# Altium project ATSAME54_DEVB.PrjPCB
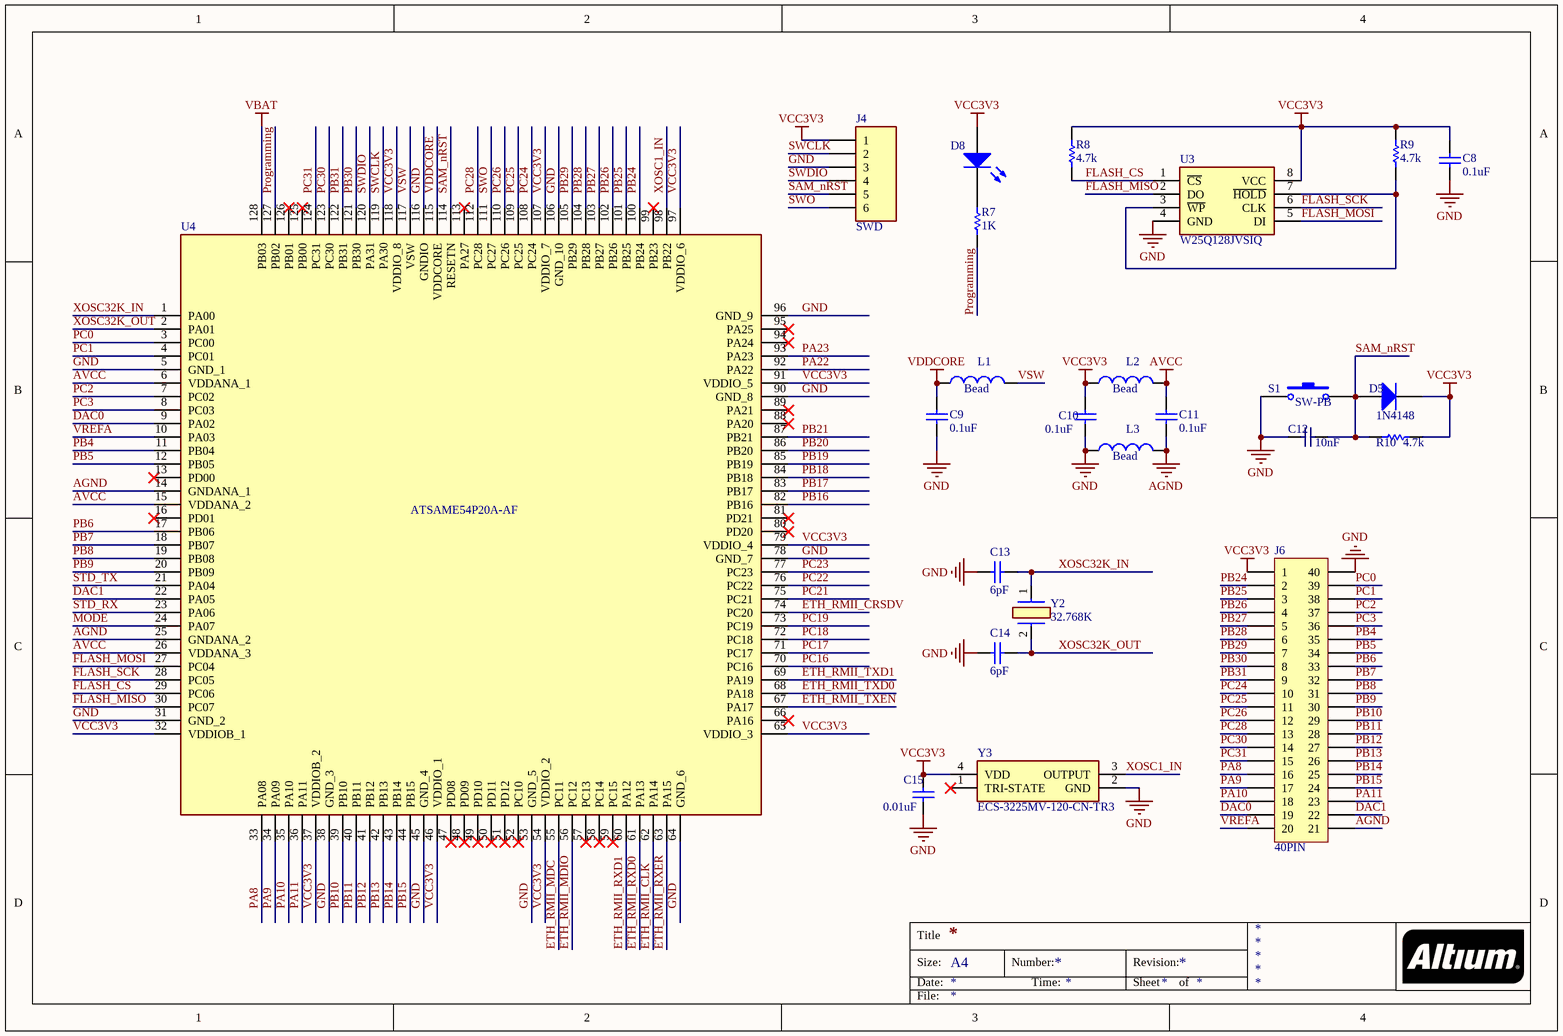
[diagram p0: Main_MCU_ATSAME54.SchDoc]
3 sheets, 81 parts. Net scope: global (net labels, ports and power ports of the same name join across sheets).
Board file: ATSAME54_DEVB.PcbDoc
Sheets:
  Main_MCU_ATSAME54.SchDoc
  Aux_MCU_ATmega16U4.SchDoc
  NIC_DP83848.SchDoc

## Sheet Main_MCU_ATSAME54.SchDoc
size A4

### Parts
C8  0.1uF  [SMD0603]
C9  0.1uF  [SMD0603]
C10  0.1uF  [SMD0603]
C11  0.1uF  [SMD0603]
C12  10nF  [SMD0603]
C13  6pF  [SMD0603]
C14  6pF  [SMD0603]
C15  0.01uF  [SMD0603]
D5  1N4148  [1N4148]
D8  LED0  [SMD0603_LED]  (value not drawn)
J4  SWD  [ISP]
J6  40PIN  [40PIN]
L1  Bead  [SMD0603]
L2  Bead  [SMD0603]
L3  Bead  [SMD0603]
R7  1K  [SMD0603]
R8  4.7k  [SMD0603]
R9  4.7k  [SMD0603]
R10  4.7K  [SMD0603]
S1  SW-PB  [Button]
U3  W25Q128JVSIQ  [SOIC127P790X216-8N]
U4  ATSAME54P20A-AF  [QFP40P1600X1600X120-128N]
Y2  32.768K  [ECS327634RTR]
Y3  ECS-3225MV-120-CN-TR3  [OSC3225]

### Nets
AGND: C11.2 J6.21 L3.2 U4.14(GNDANA_1) U4.25(GNDANA_2)
AVCC: C11.1 L2.2 U4.6(VDDANA_1) U4.15(VDDANA_2) U4.26(VDDANA_3)
GND: C8.2 C9.2 C10.2 C12.1 C13.2 C14.2 C15.1 J4.3 J6.40 L3.1 S1.1 U3.4(GND) U4.5(GND_1) U4.31(GND_2) U4.38(GND_3) U4.45(GND_4) U4.53(GND_5) U4.64(GND_6) U4.78(GND_7) U4.90(GND_8) U4.96(GND_9) U4.106(GND_10) U4.116(GNDIO) Y3.2(GND)
VBAT: U4.128(PB03)
VCC3V3: C8.1 C10.1 C15.2 D5.2 D8.1(A) J4.1 J6.1 L2.1 R8.2 R9.2 R10.2 U3.8(VCC) U4.32(VDDIOB_1) U4.37(VDDIOB_2) U4.46(VDDIO_1) U4.54(VDDIO_2) U4.65(VDDIO_3) U4.79(VDDIO_4) U4.91(VDDIO_5) U4.97(VDDIO_6) U4.107(VDDIO_7) U4.118(VDDIO_8) Y3.4(VDD)
VDDCORE: C9.1 L1.1 U4.115(VDDCORE)
DAC0: J6.19 U4.9(PA02)
DAC1: J6.22 U4.22(PA05)
ETH_RMII_CLK: U4.62(PA14)
ETH_RMII_CRSDV: U4.74(PC20)
ETH_RMII_MDC: U4.55(PC11)
ETH_RMII_MDIO: U4.56(PC12)
ETH_RMII_RXD0: U4.61(PA13)
ETH_RMII_RXD1: U4.60(PA12)
ETH_RMII_RXER: U4.63(PA15)
ETH_RMII_TXD0: U4.68(PA18)
ETH_RMII_TXD1: U4.69(PA19)
ETH_RMII_TXEN: U4.67(PA17)
FLASH_CS: R8.1 U3.1(~{CS}) U4.29(PC06)
FLASH_MISO: U3.2(DO) U4.30(PC07)
FLASH_MOSI: U3.5(DI) U4.27(PC04)
FLASH_SCK: U3.6(CLK) U4.28(PC05)
MODE: U4.24(PA07)
PA8: J6.16 U4.33(PA08)
PA9: J6.17 U4.34(PA09)
PA10: J6.18 U4.35(PA10)
PA11: J6.23 U4.36(PA11)
PA22: U4.92(PA22)
PA23: U4.93(PA23)
PB4: J6.35 U4.11(PB04)
PB5: J6.34 U4.12(PB05)
PB6: J6.33 U4.17(PB06)
PB7: J6.32 U4.18(PB07)
PB8: J6.31 U4.19(PB08)
PB9: J6.30 U4.20(PB09)
PB10: J6.29 U4.39(PB10)
PB11: J6.28 U4.40(PB11)
PB12: J6.27 U4.41(PB12)
PB13: J6.26 U4.42(PB13)
PB14: J6.25 U4.43(PB14)
PB15: J6.24 U4.44(PB15)
PB16: U4.82(PB16)
PB17: U4.83(PB17)
PB18: U4.84(PB18)
PB19: U4.85(PB19)
PB20: U4.86(PB20)
PB21: U4.87(PB21)
PB24: J6.2 U4.100(PB24)
PB25: J6.3 U4.101(PB25)
PB26: J6.4 U4.102(PB26)
PB27: J6.5 U4.103(PB27)
PB28: J6.6 U4.104(PB28)
PB29: J6.7 U4.105(PB29)
PB30: J6.8 U4.121(PB30)
PB31: J6.9 U4.122(PB31)
PC0: J6.39 U4.3(PC00)
PC1: J6.38 U4.4(PC01)
PC2: J6.37 U4.7(PC02)
PC3: J6.36 U4.8(PC03)
PC16: U4.70(PC16)
PC17: U4.71(PC17)
PC18: U4.72(PC18)
PC19: U4.73(PC19)
PC21: U4.75(PC21)
PC22: U4.76(PC22)
PC23: U4.77(PC23)
PC24: J6.10 U4.108(PC24)
PC25: J6.11 U4.109(PC25)
PC26: J6.12 U4.110(PC26)
PC28: J6.13 U4.112(PC28)
PC30: J6.14 U4.123(PC30)
PC31: J6.15 U4.124(PC31)
Programming: R7.1 U4.127(PB02)
SAM_nRST: C12.2 D5.1 J4.5 R10.1 S1.2 U4.114(RESETN)
STD_RX: U4.23(PA06)
STD_TX: U4.21(PA04)
SWCLK: J4.2 U4.119(PA30)
SWDIO: J4.4 U4.120(PA31)
SWO: J4.6 U4.111(PC27)
VREFA: J6.20 U4.10(PA03)
VSW: L1.2 U4.117(VSW)
XOSC1_IN: U4.98(PB22) Y3.3(OUTPUT)
XOSC32K_IN: C13.1 U4.1(PA00) Y2.1(OUT/IN)
XOSC32K_OUT: C14.1 U4.2(PA01) Y2.2(OUT/IN)
NetD8_2: D8.2(K) R7.2
NetR9_1: R9.1 U3.3(~{WP}) U3.7(~{HOLD})

Not connected (* = marked no-connect by the designer): U4 13(PD00)* 16(PD01)* 47(PD08)* 48(PD09)* 49(PD10)* 50(PD11)* 51(PD12)* 52(PC10)* 57(PC13)* 58(PC14)* 59(PC15)* 66(PA16)* 80(PD20)* 81(PD21)* 88(PA20)* 89(PA21)* 94(PA24)* 95(PA25)* 99(PB23)* 113(PA27)* 125(PB00)* 126(PB01)*; Y3 1(TRI-STATE)*

### Notes on the sheet
- Title
- Size:
- Date:
- A4
- Number:
- Time:
- Revision:
- Sheet
- of
- File:

### Library data of the parts
C8-C11 C13-C15 = Cap Semi: Capacitor (Semiconductor SIM Model); Published: 8-Jun-2000; LatestRevisionDate: 29-May-2009; LatestRevisionNote: IPC-7351 Footprint Added.; PackageReference: C1206; Publisher: Altium Limited; PackageDescription: Chip Capacitor
  C8-C11: Value: 0.1uF
  C13 C14: Value: 6pF
  C15: Value: 0.01uF
C12 = Cap: Capacitor (Semiconductor SIM Model); Value: 10nF
D5 = Diode 1N4148: Diode; Note: Pin 2 is not connected and not drawn.; Published: 21-Mar-2003; DatasheetDocument: Oct-1999; PackageDocument: Sep-2001; PackageReference: SOT-23; Publisher: Altium Limited; ComponentLink1Description: Manufacturer Link; ComponentLink1URL: http://www.infineon.com/
D8 = LED0: Typical INFRARED GaAs LED; Published: 8-Jun-2000; LatestRevisionDate: 08-Jul-2005; LatestRevisionNote: Mech Layer 1 removed.; PackageReference: LED-0; Publisher: Altium Limited; PackageDescription: LED; 2 Leads
J6 = 2x20_header
L1-L3 = Inductor: Code_IEC: 1005; Published: 8-Jun-2000; LatestRevisionDate: 29-May-2009; LatestRevisionNote: IPC-7351 Footprint Added.; PackageReference: 0402-A; Publisher: Altium Limited; PackageDescription: Chip Inductor; Code_JEITA: 0402; Value: Bead
R7 = Res Semi: Semiconductor Resistor; Published: 8-Jun-2000; LatestRevisionDate: 17-Jul-2002; LatestRevisionNote: Re-released for DXP Platform.; PackageReference: AXIAL-0.5; Publisher: Altium Limited; PackageDescription: Axial Device, Thru-Hole; 2 Leads; 0.5 in Pin Spacing; Value: 1K
R8-R10 = Res: Semiconductor Resistor; Value: 4.7k
S1 = SW-PB: Switch; Published: 24-Mar-1999; LatestRevisionDate: 17-Jul-2002; LatestRevisionNote: Re-released for DXP Platform.; PackageReference: SPST-2; Publisher: Altium Limited; PackageDescription: Switch; 2 Leads
U3 = W25Q128JVSIQ: Integrated Circuit; Manufacturer_Name: Winbond; Datasheet Link: https://componentsearchengine.com//W25Q128JVSIQ.pdf; Height: 2.16mm; Mouser2 Part Number: 454-W25Q128JVSIQ; Mouser2 Price/Stock: https://www.mouser.com/Search/Refine.aspx?Keyword=454-W25Q128JVSIQ; Manufacturer_Part_Number: W25Q128JVSIQ
U4 = ATSAME54P20A-AF: Integrated Circuit; Manufacturer_Name: Microchip; Datasheet Link: https://componentsearchengine.com//ATSAME54P20A-AF.pdf; Height: 1.2mm; Mouser2 Part Number: 556-ATSAME54P20A-AF; Mouser2 Price/Stock: https://www.mouser.com/Search/Refine.aspx?Keyword=556-ATSAME54P20A-AF; Manufacturer_Part_Number: ATSAME54P20A-AF
Y2 = ECS-.327-6-34R-TR: Crystal or Oscillator; Manufacturer_Name: ECS; Datasheet Link: https://ecsxtal.com/store/pdf/ECX_34R.pdf; Height: 0.9mm; Manufacturer_Part_Number: ECS-.327-6-34R-TR
Y3 = ECS-3225MV-120-CN-TR3: Crystal or Oscillator; Manufacturer_Name: ECS; Datasheet Link: https://ecsxtal.com/store/pdf/ECS-3225MV.pdf; Height: 1.2mm; Manufacturer_Part_Number: ECS-3225MV-120-CN-TR3

## Sheet Aux_MCU_ATmega16U4.SchDoc
size A4
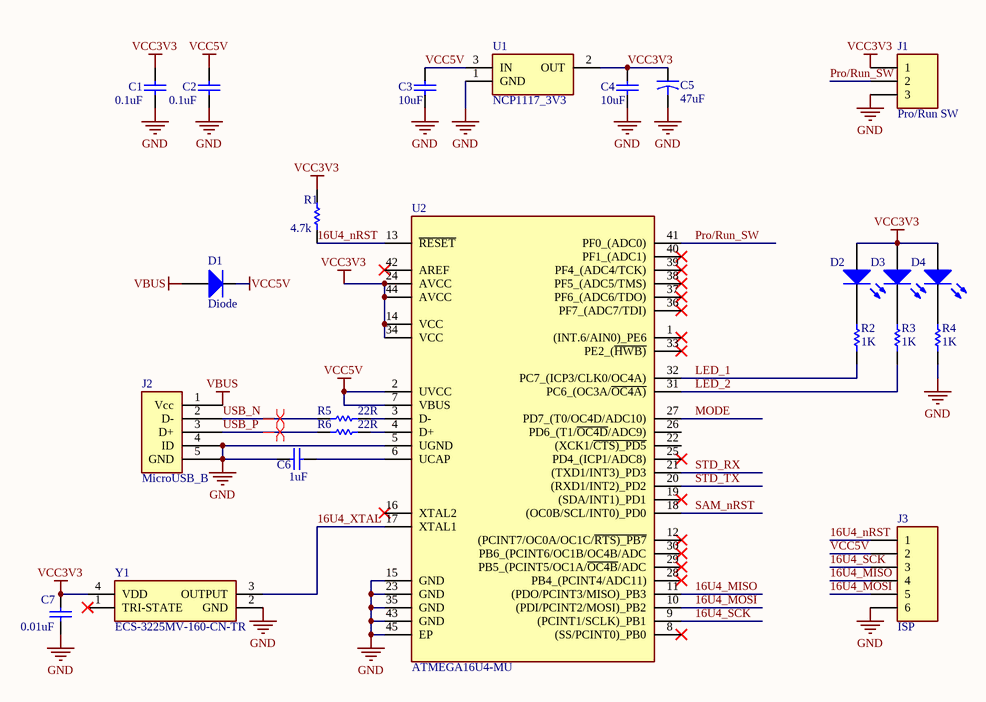
[diagram p1: Aux_MCU_ATmega16U4.SchDoc]

### Parts
C1  0.1uF  [SMD0603]
C2  0.1uF  [SMD0603]
C3  10uF  [SMD0603]
C4  10uF  [SMD0603]
C5  47uF  [TAJ_CLASS_C]
C6  1uF  [SMD0603]
C7  0.01uF  [SMD0603]
D1  Diode  [SMB_DIODE_B130LB]
D2  LED0  [SMD0603_LED]  (value not drawn)
D3  LED0  [SMD0603_LED]  (value not drawn)
D4  LED0  [SMD0603_LED]  (value not drawn)
J1  Pro/Run SW  [SLIDE_SW_3P]
J2  MicroUSB_B  [micro_usb_molex_105017-0001]
J3  ISP  [ISP]
R1  4.7K  [SMD0603]
R2  1K  [SMD0603]
R3  1K  [SMD0603]
R4  1K  [SMD0603]
R5  22R  [SMD0603]
R6  22R  [SMD0603]
U1  NCP1117_3V3  [SOT-223-2]
U2  ATMEGA16U4-MU  [QFN50P700X700X100-45N-D]
Y1  ECS-3225MV-160-CN-TR  [OSC3225]

### Nets
GND: C1.2 C2.2 C3.1 C4.1 C5.2 C6.1 C7.1 J1.3 J2.4(ID) J2.5(GND) J3.6 R4.1 U1.1(GND) U2.5(UGND) U2.15(GND) U2.23(GND) U2.35(GND) U2.43(GND) U2.45(EP) Y1.2(GND)
VBUS: D1.1(A) J2.1(Vcc)
VCC3V3: C1.1 C4.2 C5.1 C7.2 D2.1(A) D3.1(A) D4.1(A) J1.1 R1.2 U1.2(OUT) U2.14(VCC) U2.24(AVCC) U2.34(VCC) U2.44(AVCC) Y1.4(VDD)
VCC5V: C2.1 C3.2 D1.2(K) J3.2 U1.3(IN) U2.2(UVCC) U2.7(VBUS)
16U4_MISO: J3.4 U2.11((PDO/PCINT3/MISO)_PB3)
16U4_MOSI: J3.5 U2.10((PDI/PCINT2/MOSI)_PB2)
16U4_nRST: J3.1 R1.1 U2.13(~{RESET})
16U4_SCK: J3.3 U2.9((PCINT1/SCLK)_PB1)
16U4_XTAL: U2.17(XTAL1) Y1.3(OUTPUT)
LED_1: R2.1 U2.32(PC7_(ICP3/CLK0/OC4A))
LED_2: R3.1 U2.31(PC6_(OC3A/~{OC4A)})
MODE: U2.27(PD7_(T0/OC4D/ADC10))
Pro/Run_SW: J1.2 U2.41(PF0_(ADC0))
SAM_nRST: U2.18((OC0B/SCL/INT0)_PD0)
STD_RX: U2.21((TXD1/INT3)_PD3)
STD_TX: U2.20((RXD1/INT2)_PD2)
USB_N: J2.2(D-) R5.2
USB_P: J2.3(D+) R6.2
NetC6_2: C6.2 U2.6(UCAP)
NetD2_2: D2.2(K) R2.2
NetD3_2: D3.2(K) R3.2
NetD4_2: D4.2(K) R4.2
NetR5_1: R5.1 U2.3(D-)
NetR6_1: R6.1 U2.4(D+)

Not connected (* = marked no-connect by the designer): U2 1((INT.6/AIN0)_PE6)* 8((SS/PCINT0)_PB0)* 12((PCINT7/OC0A/OC1C/~{RTS)_PB7})* 16(XTAL2)* 19((SDA/INT1)_PD1)* 22((XCK1/~{CTS)_PD5}) 25(PD4_(ICP1/ADC8))* 26(PD6_(T1/~{OC4D}/ADC9)) 28(PB4_(PCINT4/ADC11))* 29(PB5_(PCINT5/OC1A/~{OC4B}/ADC)* 30(PB6_(PCINT6/OC1B/OC4B/ADC)* 33(PE2_(~{HWB)})* 36(PF7_(ADC7/TDI))* 37(PF6_(ADC6/TDO))* 38(PF5_(ADC5/TMS))* 39(PF4_(ADC4/TCK))* 40(PF1_(ADC1))* 42(AREF)*; Y1 1(TRI-STATE)*

### Layout directives
differential pair: USB_N, USB_P

### Notes on the sheet
- Title
- Size:
- Date:
- A4
- Number:
- Time:
- Revision:
- Sheet
- of
- File:

### Library data of the parts
C1-C4 C6 C7 = Cap Semi: Capacitor (Semiconductor SIM Model); Published: 8-Jun-2000; LatestRevisionDate: 29-May-2009; LatestRevisionNote: IPC-7351 Footprint Added.; PackageReference: C1206; Publisher: Altium Limited; PackageDescription: Chip Capacitor
  C1 C2: Value: 0.1uF
  C3 C4: Value: 10uF
  C6: Value: 1uF
  C7: Value: 0.01uF
C5 = Cap2: Capacitor; Published: 23-Sep-2002; PackageReference: CAPR5-4X5; Publisher: Altium Limited; Value: 47uF
D1 = Diode: Default Diode; Published: 8-Jun-2000; LatestRevisionDate: 17-Jul-2002; LatestRevisionNote: Re-released for DXP Platform.; PackageVersion: Sep-1996; PackageReference: SMC; Publisher: Altium Limited; PackageDescription: DO-214-AB/SMC; 2 C-Bend Leads; Body 7.9 x 5.9 mm, inc. leads (LxW); Code_JEDEC: DO-214-AB
D2-D4 = LED0: Typical INFRARED GaAs LED; Published: 8-Jun-2000; LatestRevisionDate: 08-Jul-2005; LatestRevisionNote: Mech Layer 1 removed.; PackageReference: LED-0; Publisher: Altium Limited; PackageDescription: LED; 2 Leads
J1 = Pro/Run SW: Program/Run Switch
R1 R5 R6 = Res: Semiconductor Resistor
  R1: Value: 4.7k
  R5 R6: Value: 22R
R2-R4 = Res Semi: Semiconductor Resistor; Published: 8-Jun-2000; LatestRevisionDate: 17-Jul-2002; LatestRevisionNote: Re-released for DXP Platform.; PackageReference: AXIAL-0.5; Publisher: Altium Limited; PackageDescription: Axial Device, Thru-Hole; 2 Leads; 0.5 in Pin Spacing; Value: 1K
U1 = NCP1117_3V3: IC REG 3.3V 1A DPAC
U2 = ATMEGA16U4-MU: Integrated Circuit; Manufacturer_Name: Microchip; Datasheet Link: http://ww1.microchip.com/downloads/en/DeviceDoc/Atmel-7766-8-bit-AVR-ATmega16U4-32U4_Summary.pdf; Height: 1mm; Manufacturer_Part_Number: ATMEGA16U4-MU
Y1 = ECS-3225MV-160-CN-TR: Crystal or Oscillator; Manufacturer_Name: ECS; Datasheet Link: https://componentsearchengine.com//ECS-3225MV-160-CN-TR.pdf; Height: 1.2mm; Mouser2 Part Number: 520-3225MV-160-CNT; Mouser2 Price/Stock: https://www.mouser.com/Search/Refine.aspx?Keyword=520-3225MV-160-CNT; Manufacturer_Part_Number: ECS-3225MV-160-CN-TR

## Sheet NIC_DP83848.SchDoc
size A4
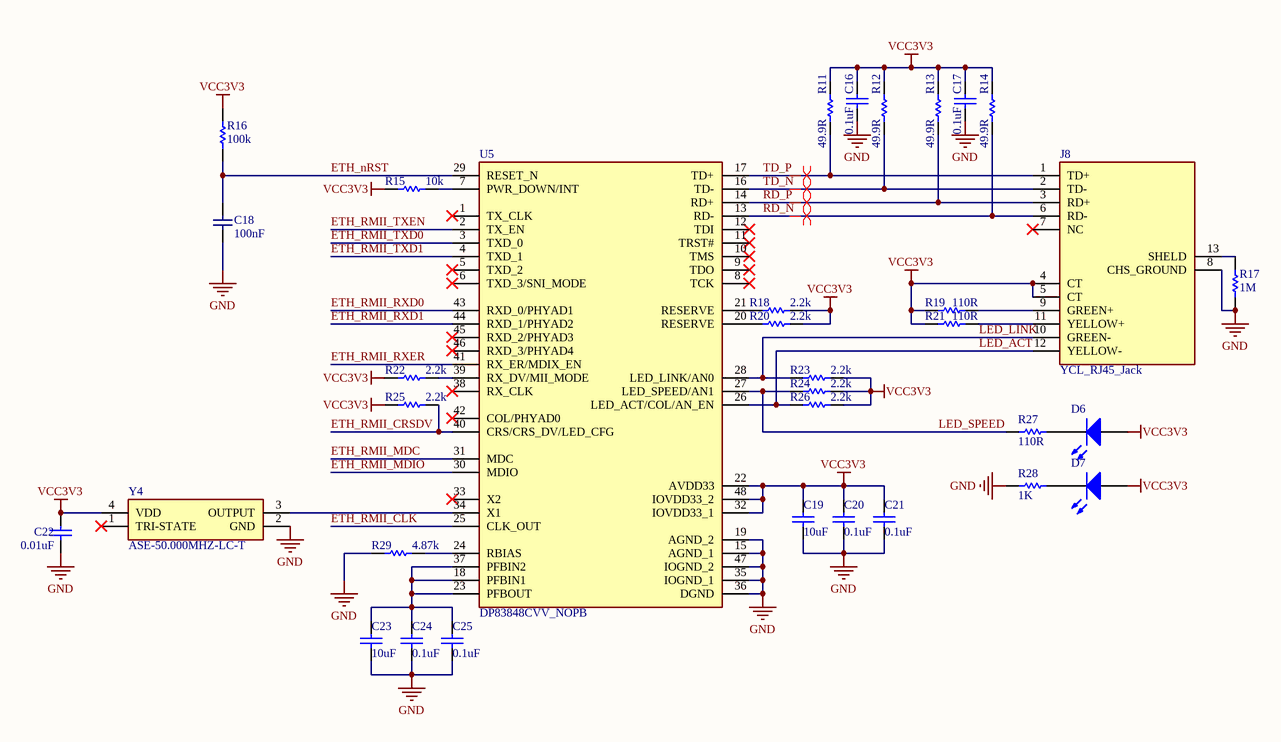
[diagram p2: NIC_DP83848.SchDoc]

### Parts
C16  0.1uF  [SMD0603]
C17  0.1uF  [SMD0603]
C18  100nF  [SMD0603]
C19  10uF  [SMD0603]
C20  0.1uF  [SMD0603]
C21  0.1uF  [SMD0603]
C22  value 0.01uF  [SMD0603]  (hidden comment: 0.1uF)
C23  10uF  [SMD0603]
C24  0.1uF  [SMD0603]
C25  0.1uF  [SMD0603]
D6  LED0  [SMD0603_LED]  (value not drawn)
D7  LED0  [SMD0603_LED]  (value not drawn)
J8  YCL_RJ45_Jack  [YCL_RJ45_Jack]
R11  49.9R  [SMD0603]
R12  49.9R  [SMD0603]
R13  49.9R  [SMD0603]
R14  49.9R  [SMD0603]
R15  10k  [SMD0603]
R16  100K  [SMD0603]
R17  1M  [SMD0603]
R18  2.2k  [SMD0603]
R19  110R  [SMD0603]
R20  2.2k  [SMD0603]
R21  110R  [SMD0603]
R22  2.2k  [SMD0603]
R23  2.2k  [SMD0603]
R24  2.2k  [SMD0603]
R25  2.2k  [SMD0603]
R26  2.2k  [SMD0603]
R27  value 110R  [SMD0603]  (hidden comment: 1K)
R28  1K  [SMD0603]
R29  4.87k  [SMD0603]
U5  DP83848CVV_NOPB  [QFP50P900X900X160-48N]
Y4  ASE-50.000MHZ-LC-T  [OSC3225]

### Nets
GND: C16.2 C17.2 C18.1 C19.2 C20.2 C21.2 C22.2 C23.2 C24.2 C25.2 J8.8(CHS_GROUND) R17.1 R28.1 R29.2 U5.15(AGND_1) U5.19(AGND_2) U5.35(IOGND_1) U5.36(DGND) U5.47(IOGND_2) Y4.2(GND)
VCC3V3: C16.1 C17.1 C19.1 C20.1 C21.1 C22.1 D6.1(A) D7.1(A) J8.4(CT) J8.5(CT) R11.1 R12.1 R13.1 R14.1 R15.2 R16.2 R18.1 R19.1 R20.2 R21.1 R22.2 R23.1 R24.2 R25.2 R26.1 U5.22(AVDD33) U5.32(IOVDD33_1) U5.48(IOVDD33_2) Y4.4(VDD)
ETH_nRST: C18.2 R16.1 U5.29(RESET_N)
ETH_RMII_CLK: U5.25(CLK_OUT)
ETH_RMII_CRSDV: R25.1 U5.40(CRS/CRS_DV/LED_CFG)
ETH_RMII_MDC: U5.31(MDC)
ETH_RMII_MDIO: U5.30(MDIO)
ETH_RMII_RXD0: U5.43(RXD_0/PHYAD1)
ETH_RMII_RXD1: U5.44(RXD_1/PHYAD2)
ETH_RMII_RXER: U5.41(RX_ER/MDIX_EN)
ETH_RMII_TXD0: U5.3(TXD_0)
ETH_RMII_TXD1: U5.4(TXD_1)
ETH_RMII_TXEN: U5.2(TX_EN)
LED_ACT: J8.12(YELLOW-) R26.2 U5.26(LED_ACT/COL/AN_EN)
LED_LINK: J8.10(GREEN-) R23.2 U5.28(LED_LINK/AN0)
LED_SPEED: R24.1 R27.1 U5.27(LED_SPEED/AN1)
RD_N: J8.6(RD-) R14.2 U5.13(RD-)
RD_P: J8.3(RD+) R13.2 U5.14(RD+)
TD_N: J8.2(TD-) R12.2 U5.16(TD-)
TD_P: J8.1(TD+) R11.2 U5.17(TD+)
NetC23_1: C23.1 C24.1 C25.1 U5.18(PFBIN1) U5.23(PFBOUT) U5.37(PFBIN2)
NetD6_2: D6.2(K) R27.2
NetD7_2: D7.2(K) R28.2
NetJ8_9: J8.9(GREEN+) R19.2
NetJ8_11: J8.11(YELLOW+) R21.2
NetJ8_13: J8.13(SHELD) R17.2
NetR15_1: R15.1 U5.7(PWR_DOWN/INT)
NetR18_2: R18.2 U5.21(RESERVE)
NetR20_1: R20.1 U5.20(RESERVE)
NetR22_1: R22.1 U5.39(RX_DV/MII_MODE)
NetR29_1: R29.1 U5.24(RBIAS)
NetU5_34: U5.34(X1) Y4.3(OUTPUT)

Not connected (* = marked no-connect by the designer): J8 7(NC)*; U5 1(TX_CLK)* 5(TXD_2)* 6(TXD_3/SNI_MODE)* 8(TCK)* 9(TDO)* 10(TMS)* 11(TRST#)* 12(TDI)* 33(X2)* 38(RX_CLK)* 42(COL/PHYAD0)* 45(RXD_2/PHYAD3)* 46(RXD_3/PHYAD4)*; Y4 1(TRI-STATE)*

### Layout directives
differential pair: RD_N, RD_P, TD_N, TD_P

### Notes on the sheet
- Title
- Size:
- Date:
- A4
- Number:
- Time:
- Revision:
- Sheet
- of
- File:

### Library data of the parts
C16 C17 C19-C25 = Cap Semi: Capacitor (Semiconductor SIM Model); Published: 8-Jun-2000; LatestRevisionDate: 29-May-2009; LatestRevisionNote: IPC-7351 Footprint Added.; PackageReference: C1206; Publisher: Altium Limited; PackageDescription: Chip Capacitor
  C16 C17 C20 C21 C24 C25: Value: 0.1uF
  C19 C23: Value: 10uF
C18 = Cap: Capacitor (Semiconductor SIM Model); Value: 100nF
D6 D7 = LED0: Typical INFRARED GaAs LED; Published: 8-Jun-2000; LatestRevisionDate: 08-Jul-2005; LatestRevisionNote: Mech Layer 1 removed.; PackageReference: LED-0; Publisher: Altium Limited; PackageDescription: LED; 2 Leads
J8 = YCL_RJ45_Jack: Connector; Manufacturer_Name: Pulse; Manufacturer_Part_Number: J0011D21BNL; Datasheet Link: https://www.mouser.de/datasheet/2/336/J403-370307.pdf; Height: 16.39mm
R11-R15 R17-R29 = Res Semi: Semiconductor Resistor; Published: 8-Jun-2000; LatestRevisionDate: 17-Jul-2002; LatestRevisionNote: Re-released for DXP Platform.; PackageReference: AXIAL-0.5; Publisher: Altium Limited; PackageDescription: Axial Device, Thru-Hole; 2 Leads; 0.5 in Pin Spacing
  R11-R14: Value: 49.9R
  R15: Value: 10k
  R17: Value: 1M
  R18 R20 R22-R26: Value: 2.2k
  R19 R21: Value: 110R
  R28: Value: 1K
  R29: Value: 4.87k
R16 = Res: Semiconductor Resistor; Value: 100k
U5 = DP83848CVV: Ethernet phy
Y4 = ASE-50.000MHZ-LC-T: Crystal or Oscillator; Manufacturer_Name: ABRACON; Datasheet Link: https://componentsearchengine.com//ASE-50.000MHZ-LC-T.pdf; Height: 1.2mm; Mouser2 Part Number: 815-ASE50.000MHZLCT; Mouser2 Price/Stock: https://www.mouser.com/Search/Refine.aspx?Keyword=815-ASE50.000MHZLCT; Manufacturer_Part_Number: ASE-50.000MHZ-LC-T

## Nets that join several sheets
GND: Main_MCU_ATSAME54 (24 pins), Aux_MCU_ATmega16U4 (20 pins), NIC_DP83848 (20 pins)
VCC3V3: Main_MCU_ATSAME54 (23 pins), Aux_MCU_ATmega16U4 (15 pins), NIC_DP83848 (29 pins)
ETH_RMII_CLK: Main_MCU_ATSAME54 (U4.62), NIC_DP83848 (U5.25)
ETH_RMII_CRSDV: Main_MCU_ATSAME54 (U4.74), NIC_DP83848 (R25.1 U5.40)
ETH_RMII_MDC: Main_MCU_ATSAME54 (U4.55), NIC_DP83848 (U5.31)
ETH_RMII_MDIO: Main_MCU_ATSAME54 (U4.56), NIC_DP83848 (U5.30)
ETH_RMII_RXD0: Main_MCU_ATSAME54 (U4.61), NIC_DP83848 (U5.43)
ETH_RMII_RXD1: Main_MCU_ATSAME54 (U4.60), NIC_DP83848 (U5.44)
ETH_RMII_RXER: Main_MCU_ATSAME54 (U4.63), NIC_DP83848 (U5.41)
ETH_RMII_TXD0: Main_MCU_ATSAME54 (U4.68), NIC_DP83848 (U5.3)
ETH_RMII_TXD1: Main_MCU_ATSAME54 (U4.69), NIC_DP83848 (U5.4)
ETH_RMII_TXEN: Main_MCU_ATSAME54 (U4.67), NIC_DP83848 (U5.2)
MODE: Main_MCU_ATSAME54 (U4.24), Aux_MCU_ATmega16U4 (U2.27)
SAM_nRST: Main_MCU_ATSAME54 (6 pins), Aux_MCU_ATmega16U4 (U2.18)
STD_RX: Main_MCU_ATSAME54 (U4.23), Aux_MCU_ATmega16U4 (U2.21)
STD_TX: Main_MCU_ATSAME54 (U4.21), Aux_MCU_ATmega16U4 (U2.20)